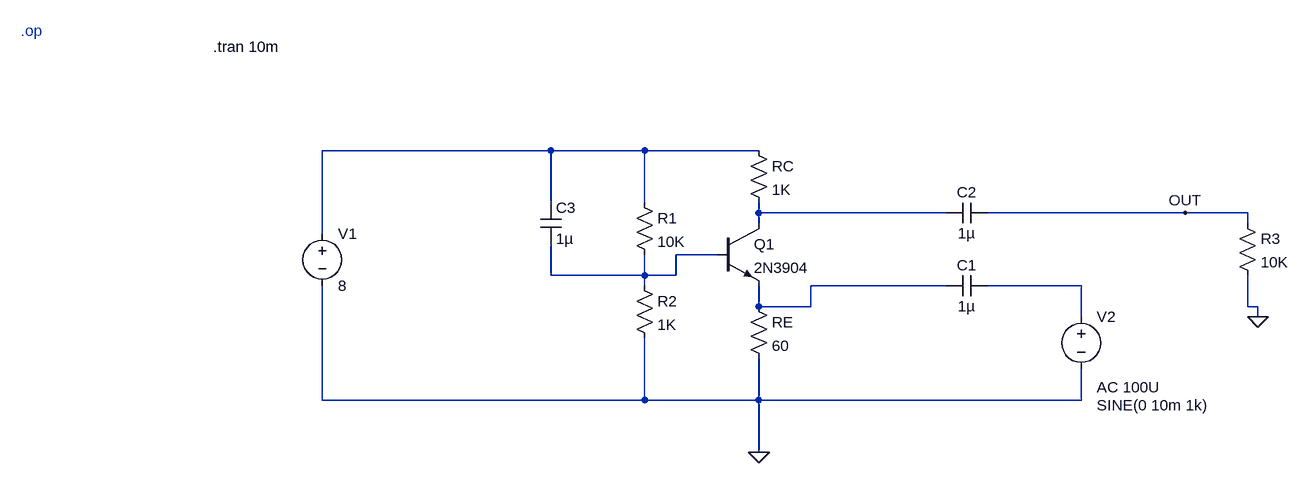
[diagram p0: schematic common base amplifier.asc]
common base amplifier.asc, the LTspice schematic file:
Version 4.1
SHEET 1 1076 680
WIRE -64 0 -416 0
WIRE 80 0 -64 0
WIRE 256 0 80 0
WIRE -64 80 -64 0
WIRE 80 80 80 0
WIRE 256 96 256 80
WIRE 544 96 256 96
WIRE 912 96 608 96
WIRE 1008 96 912 96
WIRE 256 112 256 96
WIRE 1008 112 1008 96
WIRE -416 128 -416 0
WIRE 192 160 128 160
WIRE -64 192 -64 144
WIRE 80 192 80 160
WIRE 80 192 -64 192
WIRE 128 192 128 160
WIRE 128 192 80 192
WIRE 80 208 80 192
WIRE 544 208 336 208
WIRE 752 208 608 208
WIRE 256 240 256 208
WIRE 336 240 336 208
WIRE 336 240 256 240
WIRE 1008 240 1008 192
WIRE 1024 240 1008 240
WIRE 752 256 752 208
WIRE 1024 256 1024 240
WIRE -416 384 -416 208
WIRE 80 384 80 288
WIRE 80 384 -416 384
WIRE 256 384 256 320
WIRE 256 384 80 384
WIRE 752 384 752 336
WIRE 752 384 256 384
WIRE 256 464 256 384
FLAG 256 464 0
FLAG 1024 256 0
FLAG 912 96 OUT
SYMBOL npn 192 112 R0
SYMATTR InstName Q1
SYMATTR Value 2N3904
SYMBOL res 64 64 R0
SYMATTR InstName R1
SYMATTR Value 10K
SYMBOL res 64 192 R0
SYMATTR InstName R2
SYMATTR Value 1K
SYMBOL res 240 -16 R0
SYMATTR InstName RC
SYMATTR Value 1K
SYMBOL res 240 224 R0
SYMATTR InstName RE
SYMATTR Value 60
SYMBOL voltage -416 112 R0
SYMATTR InstName V1
SYMATTR Value 8
SYMBOL cap 608 192 R90
WINDOW 0 0 32 VBottom 2
WINDOW 3 32 32 VTop 2
SYMATTR InstName C1
SYMATTR Value 1µ
SYMBOL voltage 752 240 R0
WINDOW 3 24 152 Left 2
WINDOW 123 24 124 Left 2
WINDOW 39 0 0 Left 0
SYMATTR InstName V2
SYMATTR Value SINE(0 10m 1k)
SYMATTR Value2 AC 100U
SYMBOL cap 608 80 R90
WINDOW 0 0 32 VBottom 2
WINDOW 3 32 32 VTop 2
SYMATTR InstName C2
SYMATTR Value 1µ
SYMBOL res 992 96 R0
SYMATTR InstName R3
SYMATTR Value 10K
SYMBOL cap -80 80 R0
SYMATTR InstName C3
SYMATTR Value 1µ
TEXT -880 -184 Left 2 ;.op
TEXT -584 -160 Left 2 !.tran 10m

The netlist it stands for:
* common base amplifier.asc
Q1 N002 N003 N004 0 2N3904
R1 N001 N003 10K
R2 N003 0 1K
RC N001 N002 1K
RE N004 0 60
V1 N001 0 8
C1 N005 N004 1µ
V2 N005 0 SINE(0 10m 1k) AC 100U
C2 OUT N002 1µ
R3 OUT 0 10K
C3 N001 N003 1µ
.model NPN NPN
.model PNP PNP
.lib standard.bjt
* .op
.tran 10m
.backanno
.end